# Altium schematic sheet Key_Input.SchDoc
size A
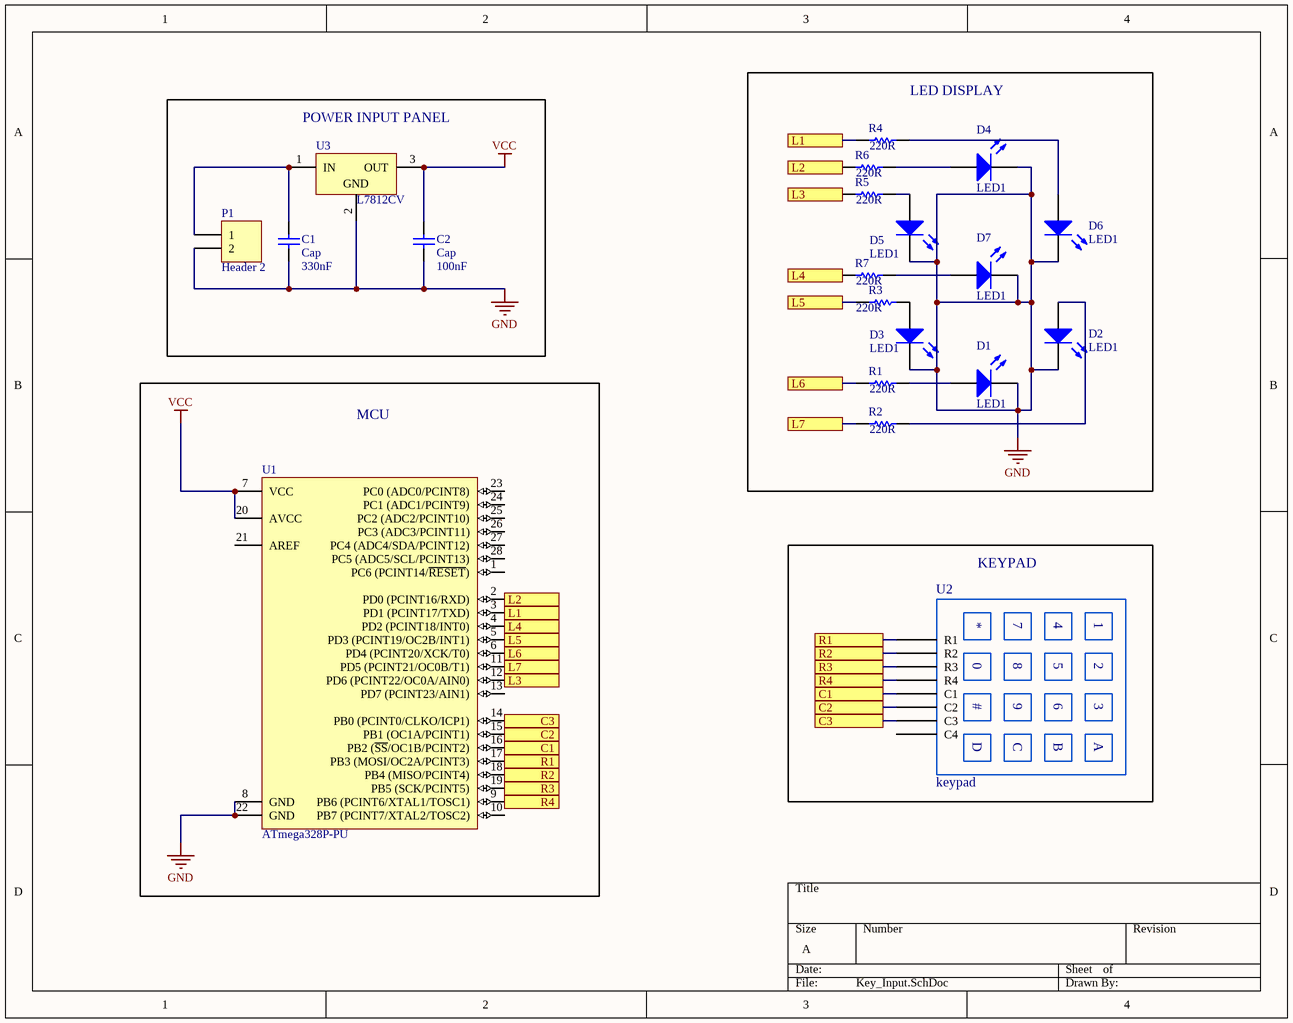
[diagram p0: Key_Input.SchDoc]

## Parts
C1  Cap  value 330nF  [RAD-0.3]
C2  Cap  value 100nF  [RAD-0.3]
D1  LED1  [LED-1]
D2  LED1  [LED-1]
D3  LED1  [LED-1]
D4  LED1  [LED-1]
D5  LED1  [LED-1]
D6  LED1  [LED-1]
D7  LED1  [LED-1]
P1  Header 2  [HDR1X2]
R1  value 220R  [AXIAL-0.3]  (hidden comment: Res1)
R2  value 220R  [AXIAL-0.3]  (hidden comment: Res1)
R3  value 220R  [AXIAL-0.3]  (hidden comment: Res1)
R4  value 220R  [AXIAL-0.3]  (hidden comment: Res1)
R5  value 220R  [AXIAL-0.3]  (hidden comment: Res1)
R6  value 220R  [AXIAL-0.3]  (hidden comment: Res1)
R7  value 220R  [AXIAL-0.3]  (hidden comment: Res1)
U1  ATmega328P-PU  [28P3]
U2  keypad  [PCBComponent_1]
U3  L7812CV  [TO220]

## Blocks framed on the sheet
LED DISPLAY: D1-D7 R1-R7
POWER INPUT PANEL: C1 C2 P1 U3
MCU: U1
KEYPAD: U2

## Ports
C1, C2, C3, L1, L2, L3, L4, L5, L6, L7, R1, R2, R3, R4

## Nets
GND: C1.2 C2.2 D1.2(K) D2.2(K) D3.2(K) D4.2(K) D5.2(K) D6.2(K) D7.2(K) P1.2 U1.8(GND) U1.22(GND) U3.2(GND)
VCC: C2.1 U1.7(VCC) U1.20(AVCC) U3.3(OUT)
C1: U1.16(PB2_(~{SS}/OC1B/PCINT2)) U2.C1 ; port C1
C2: U1.15(PB1_(OC1A/PCINT1)) U2.C2 ; port C2
C3: U1.14(PB0_(PCINT0/CLKO/ICP1)) U2.C3 ; port C3
L1: R4.1 U1.3(PD1_(PCINT17/TXD)) ; port L1
L2: R6.1 U1.2(PD0_(PCINT16/RXD)) ; port L2
L3: R5.1 U1.12(PD6_(PCINT22/OC0A/AIN0)) ; port L3
L4: R7.1 U1.4(PD2_(PCINT18/INT0)) ; port L4
L5: R3.1 U1.5(PD3_(PCINT19/OC2B/INT1)) ; port L5
L6: R1.1 U1.6(PD4_(PCINT20/XCK/T0)) ; port L6
L7: R2.1 U1.11(PD5_(PCINT21/OC0B/T1)) ; port L7
R1: U1.17(PB3_(MOSI/OC2A/PCINT3)) U2.R1 ; port R1
R2: U1.18(PB4_(MISO/PCINT4)) U2.R2 ; port R2
R3: U1.19(PB5_(SCK/PCINT5)) U2.R3 ; port R3
R4: U1.9(PB6_(PCINT6/XTAL1/TOSC1)) U2.R4 ; port R4
NetC1_1: C1.1 P1.1 U3.1(IN)
NetD1_1: D1.1(A) R1.2
NetD2_1: D2.1(A) R2.2
NetD3_1: D3.1(A) R3.2
NetD4_1: D4.1(A) R6.2
NetD5_1: D5.1(A) R5.2
NetD6_1: D6.1(A) R4.2
NetD7_1: D7.1(A) R7.2

Not connected (* = marked no-connect by the designer): U1 1(PC6_(PCINT14/~{RESET})) 10(PB7_(PCINT7/XTAL2/TOSC2)) 13(PD7_(PCINT23/AIN1)) 21(AREF) 23(PC0_(ADC0/PCINT8)) 24(PC1_(ADC1/PCINT9)) 25(PC2_(ADC2/PCINT10)) 26(PC3_(ADC3/PCINT11)) 27(PC4_(ADC4/SDA/PCINT12)) 28(PC5_(ADC5/SCL/PCINT13)); U2 C4

## Notes on the sheet
- (in symbol keypad) 7; 4; 1; 0; 8; 5; 2; #; 9; 6; 3; D; C; B; A

## Library data of the parts
C1 C2 = Cap: Capacitor; Published: 8-Jun-2000; LatestRevisionDate: 17-Jul-2002; LatestRevisionNote: Re-released for DXP Platform.; PackageReference: RAD-0.3; Publisher: Altium Limited; PackageDescription: Radial Cap, Thru-Hole; 2 Leads; 0.3 in Pin Spacing
D1-D7 = LED1: Typical RED GaAs LED; Published: 8-Jun-2000; LatestRevisionDate: 08-Jul-2005; LatestRevisionNote: Mech Layer 1 removed.; PackageReference: LED-1; Publisher: Altium Limited; PackageDescription: LED; 2 Leads
P1 = Header 2: Header, 2-Pin; LatestRevisionDate: 17-Jul-2002; LatestRevisionNote: Re-released for DXP Platform.; Publisher: Altium Limited
R1-R7 = Res1: Resistor; Published: 8-Jun-2000; LatestRevisionDate: 17-Jul-2002; LatestRevisionNote: Re-released for DXP Platform.; PackageReference: AXIAL-0.3; Publisher: Altium Limited; PackageDescription: Axial Device, Thru-Hole; 2 Leads; 0.3 in Pin Spacing
U1 = CMP-0095-00013-2: 8-bit AVR Microcontroller, 32KB Flash, 1KB EEPROM, 2KB SRAM, 28-pin PDIP, Industrial Grade (-40°C to 85°C); RevisionNote: DatasheetVersion updated. URLs added.; PackageVersion: revB, Sep-2001; PackageDescription: 28-lead (0.300"/7.62mm Wide) Plastic Dual Inline Package (PDIP); DatasheetVersion: revD, May-2011; ComponentLink1Description: Manufacturer URL; ComponentLink1URL: http://www.atmel.com/; PackageReference: 28P3; ComponentLink2Description: ATmega48A/48PA/88A/88PA/168A/168PA/328/328P Datasheet; ComponentLink3URL: http://www.atmel.com/dyn/resources/prod_documents/8271S.pdf; ComponentLink2URL: http://www.atmel.com/dyn/resources/prod_documents/8271.pdf; ComponentLink3Description: ATmega48A/48PA/88A/88PA/168A/168PA/328/328P Summary
U3 = CMP-0244-00450-1: Positive Voltage Regulator, 12V, 3-Pin TO-220; PackageDescription: TO, Thru-Hole, Vertical, Heatsink Mounted; 3 In-Line Leads; Pitch 2.54 mm; ComponentLink3URL: http://www.st.com/internet/com/TECHNICAL_RESOURCES/TECHNICAL_LITERATURE/PACKAGE_INFORMATION/CD00004649.pdf; ComponentLink1URL: http://www.st.com; ComponentLink2Description: Datasheet; ComponentLink3Description: Package Specification; ComponentLink2URL: http://www.st.com/internet/com/TECHNICAL_RESOURCES/TECHNICAL_LITERATURE/DATASHEET/CD00000444.pdf; DatasheetVersion: 16/11/2011; PackageVersion: ver3.0; PackageReference: TO220; ComponentLink1Description: Manufacturer URL